# Altium schematic sheet Power.SchDoc
size A4
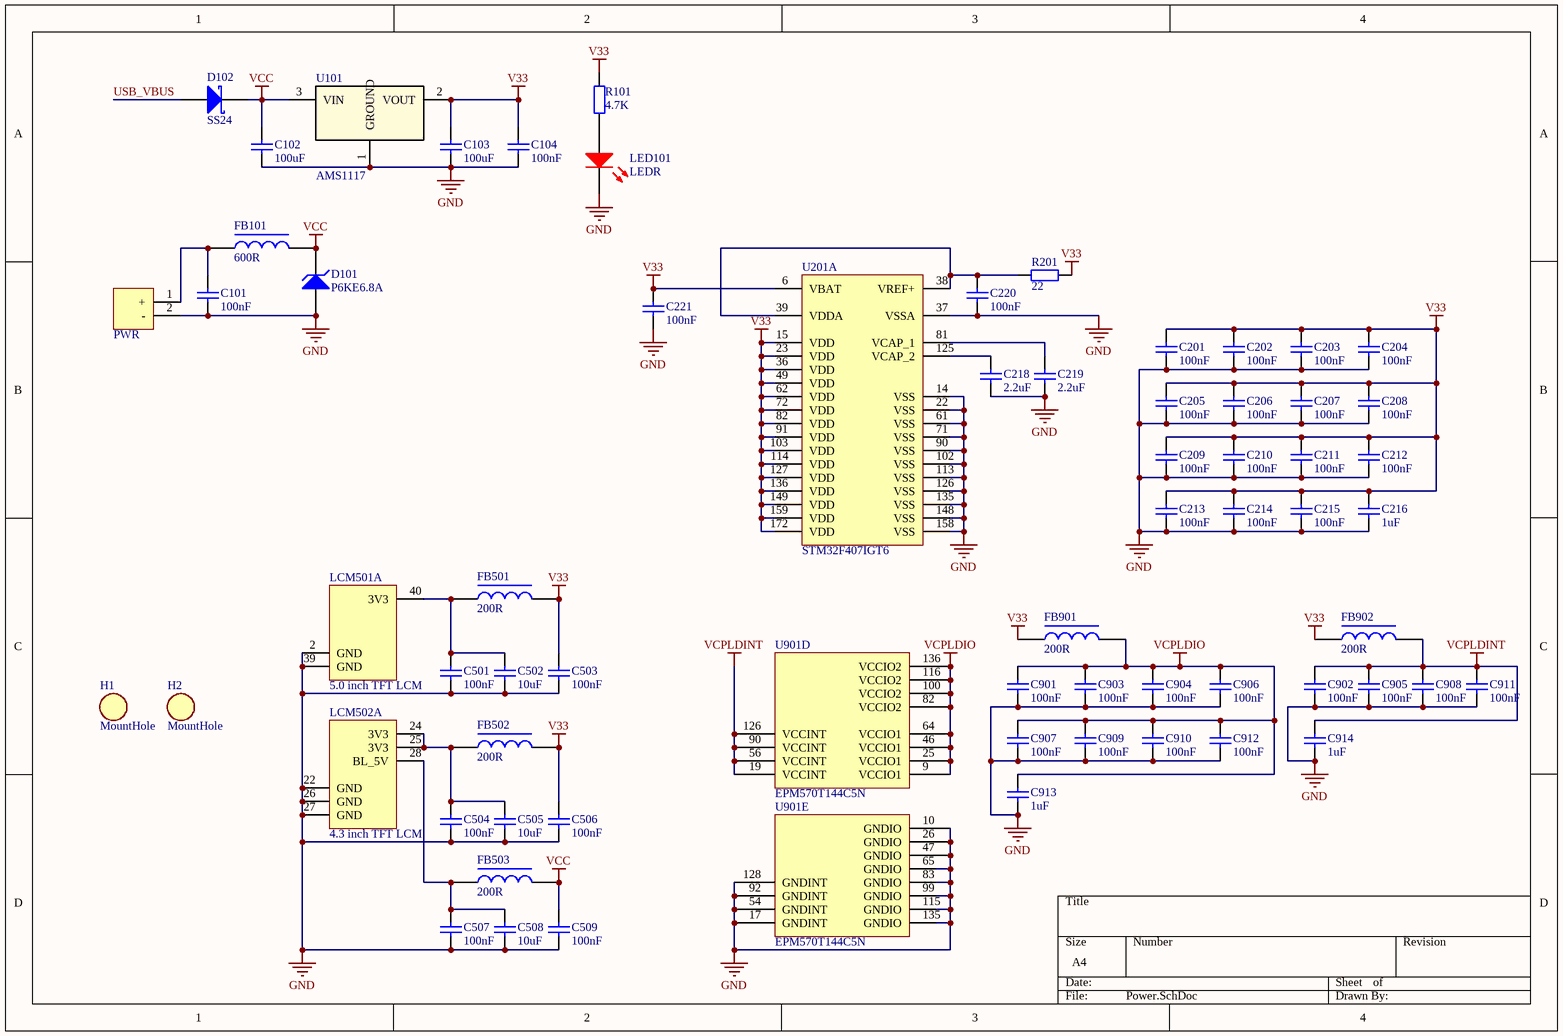
[diagram p0: Power.SchDoc]

## Parts
C101  value 100nF  [0603C]  (hidden comment: MLCC)
C102  value 100uF  [1210C]  (hidden comment: MLCC)
C103  value 100uF  [1210C]  (hidden comment: MLCC)
C104  value 100nF  [0805C]  (hidden comment: MLCC)
C201  value 100nF  [0603C]  (hidden comment: MLCC)
C202  value 100nF  [0603C]  (hidden comment: MLCC)
C203  value 100nF  [0603C]  (hidden comment: MLCC)
C204  value 100nF  [0603C]  (hidden comment: MLCC)
C205  value 100nF  [0603C]  (hidden comment: MLCC)
C206  value 100nF  [0603C]  (hidden comment: MLCC)
C207  value 100nF  [0603C]  (hidden comment: MLCC)
C208  value 100nF  [0603C]  (hidden comment: MLCC)
C209  value 100nF  [0603C]  (hidden comment: MLCC)
C210  value 100nF  [0603C]  (hidden comment: MLCC)
C211  value 100nF  [0603C]  (hidden comment: MLCC)
C212  value 100nF  [0603C]  (hidden comment: MLCC)
C213  value 100nF  [0603C]  (hidden comment: MLCC)
C214  value 100nF  [0603C]  (hidden comment: MLCC)
C215  value 100nF  [0603C]  (hidden comment: MLCC)
C216  value 1uF  [0805C]  (hidden comment: MLCC)
C218  value 2.2uF  [0805C]  (hidden comment: MLCC)
C219  value 2.2uF  [0805C]  (hidden comment: MLCC)
C220  value 100nF  [0603C]  (hidden comment: MLCC)
C221  value 100nF  [0603C]  (hidden comment: MLCC)
C501  value 100nF  [0805C]  (hidden comment: MLCC)
C502  value 10uF  [0805C]  (hidden comment: MLCC)
C503  value 100nF  [0805C]  (hidden comment: MLCC)
C504  value 100nF  [0805C]  (hidden comment: MLCC)
C505  value 10uF  [0805C]  (hidden comment: MLCC)
C506  value 100nF  [0805C]  (hidden comment: MLCC)
C507  value 100nF  [0805C]  (hidden comment: MLCC)
C508  value 10uF  [0805C]  (hidden comment: MLCC)
C509  value 100nF  [0805C]  (hidden comment: MLCC)
C901  value 100nF  [0603C]  (hidden comment: MLCC)
C902  value 100nF  [0603C]  (hidden comment: MLCC)
C903  value 100nF  [0603C]  (hidden comment: MLCC)
C904  value 100nF  [0603C]  (hidden comment: MLCC)
C905  value 100nF  [0603C]  (hidden comment: MLCC)
C906  value 100nF  [0603C]  (hidden comment: MLCC)
C907  value 100nF  [0603C]  (hidden comment: MLCC)
C908  value 100nF  [0603C]  (hidden comment: MLCC)
C909  value 100nF  [0603C]  (hidden comment: MLCC)
C910  value 100nF  [0603C]  (hidden comment: MLCC)
C911  value 100nF  [0603C]  (hidden comment: MLCC)
C912  value 100nF  [0603C]  (hidden comment: MLCC)
C913  value 1uF  [0805C]  (hidden comment: MLCC)
C914  value 1uF  [0805C]  (hidden comment: MLCC)
D101  P6KE6.8A  [SMB]
D102  SS24  [SMA]
FB101  value 600R  [1206L]  (hidden comment: FerriteBead)
FB501  value 200R  [0805L]  (hidden comment: FerriteBead)
FB502  value 200R  [0805L]  (hidden comment: FerriteBead)
FB503  value 200R  [0805L]  (hidden comment: FerriteBead)
FB901  value 200R  [0805L]  (hidden comment: FerriteBead)
FB902  value 200R  [0805L]  (hidden comment: FerriteBead)
H1  MountHole  [MOUNTHOLE]
H2  MountHole  [MOUNTHOLE]
LCM501  5.0 inch TFT LCM  [LCM5.0]  (part A of 3)
LCM502  4.3 inch TFT LCM  [LCM4.3_ATK]  (part A of 3)
LED101  LEDR  [LED1206R]
PWR  WPORT2_PWR  [VH3.96-POWER-2P]  (value not drawn)
R101  value 4.7K  [0603R]  (hidden comment: Resistor)
R201  value 22  [0603R]  (hidden comment: Resistor)
U101  AMS1117  [DCY4]
U201  STM32F407IGT6  [STM-LQFP176_N]  (part A of 7)
U901  EPM570T144C5N  [TQFP144_N]  (parts D,E of 5)

## Nets
GND: C101.1 C102.1 C103.1 C104.1 C201.1 C202.1 C203.1 C204.1 C205.1 C206.1 C207.1 C208.1 C209.1 C210.1 C211.1 C212.1 C213.1 C214.1 C215.1 C216.1 C218.1 C219.1 C220.1 C221.1 C501.1 C502.1 C503.1 C504.1 C505.1 C506.1 C507.1 C508.1 C509.1 C901.1 C902.1 C903.1 C904.1 C905.1 C906.1 C907.1 C908.1 C909.1 C910.1 C911.1 C912.1 C913.1 C914.1 D101.1(A) LCM501.2(GND) LCM501.39(GND) LCM502.22(GND) LCM502.26(GND) LCM502.27(GND) LED101.2(K) PWR.2(-) U101.1(GROUND) U201.14(VSS) U201.22(VSS) U201.37(VSSA) U201.61(VSS) U201.71(VSS) U201.90(VSS) U201.102(VSS) U201.113(VSS) U201.126(VSS) U201.135(VSS) U201.148(VSS) U201.158(VSS) U901.10(GNDIO) U901.17(GNDINT) U901.26(GNDIO) U901.47(GNDIO) U901.54(GNDINT) U901.65(GNDIO) U901.83(GNDIO) U901.92(GNDINT) U901.99(GNDIO) U901.115(GNDIO) U901.128(GNDINT) U901.135(GNDIO)
V33: C103.2 C104.2 C201.2 C202.2 C203.2 C204.2 C205.2 C206.2 C207.2 C208.2 C209.2 C210.2 C211.2 C212.2 C213.2 C214.2 C215.2 C216.2 C221.2 C503.2 C506.2 FB501.2 FB502.2 FB901.1 FB902.1 R101.2 R201.2 U101.2(VOUT) U201.6(VBAT) U201.15(VDD) U201.23(VDD) U201.36(VDD) U201.49(VDD) U201.62(VDD) U201.72(VDD) U201.82(VDD) U201.91(VDD) U201.103(VDD) U201.114(VDD) U201.127(VDD) U201.136(VDD) U201.149(VDD) U201.159(VDD) U201.172(VDD)
VCC: C102.2 C509.2 D101.2(K) D102.2(K) FB101.2 FB503.2 U101.3(VIN)
VCPLDINT: C902.2 C905.2 C908.2 C911.2 C914.2 FB902.2 U901.19(VCCINT) U901.56(VCCINT) U901.90(VCCINT) U901.126(VCCINT)
VCPLDIO: C901.2 C903.2 C904.2 C906.2 C907.2 C909.2 C910.2 C912.2 C913.2 FB901.2 U901.9(VCCIO1) U901.25(VCCIO1) U901.46(VCCIO1) U901.64(VCCIO1) U901.82(VCCIO2) U901.100(VCCIO2) U901.116(VCCIO2) U901.136(VCCIO2)
USB_VBUS: D102.1(A)
NetC101_2: C101.2 FB101.1 PWR.1(+)
NetC218_2: C218.2 U201.125(VCAP_2)
NetC219_2: C219.2 U201.81(VCAP_1)
NetC220_2: C220.2 R201.1 U201.38(VREF+) U201.39(VDDA)
NetC501_2: C501.2 C502.2 FB501.1 LCM501.40(3V3)
NetC504_2: C504.2 C505.2 FB502.1 LCM502.24(3V3) LCM502.25(3V3)
NetC507_2: C507.2 C508.2 FB503.1 LCM502.28(BL_5V)
NetLED101_1: LED101.1(A) R101.1

## Library data of the parts
D101 = P6KE6.8A: 600 Watt Peak Power Surmetict-40 Zener TransientVoltage Suppressors
D102 = SS24: Schottky Rectifier
H1 H2 = MountHole: 3mm mount hole
LCM501 = LCM5.0
LCM502 = LCM4.3_ATK
LED101 = LEDR: RED LED
PWR = WPORT2_PWR: 2 pin power port
U101 = AMS1117: 800mA LOW DROPOUT VOLTAGE REGULATOR
U201 = STM32F407IGT6: ARM Cortex-M4 32-bit MCU+FPU, 210 DMIPS, 1024 kB Flash, 192 kB Internal RAM, 140 I/Os, 176-pin LQFP, -40 to 85 degC, Tray; Manufacturer: STMicroelectronics; D/A Converter: 2x12-bit; FLASH Size (Prog) (kB): 1024; I/Os (High Current): 140; Internal RAM Size (kB): 192; Operating Frequency(F) (Processor speed) (MHz): 168; Supply Voltage(Vcc) max (V): 3.6; Supply Voltage(Vcc) min (V): 1.8; DatasheetVersion: Rev. 4; PackageVersion: Rev. 4, 06/2013; PackageReference: LQFP176; PackageDescription: 176-Pin Low Profile Quad Flat Package, 24 x 24 mm Body, 0.5 mm Pitch; Supplier 1: Digi-Key; Supplier Part Number 1: 497-11604-ND; Supplier 2: Farnell; Supplier Part Number 2: 2064366; Supplier 3: Newark; Supplier Part Number 3: 73T2331; Supplier 4: Mouser; Supplier Part Number 4: 511-STM32F407IGT6; Core: ARM Cortex-M4; Packing: Tray; Mounting Technology: Surface Mount; PartNumber: STM32F407IGT6; ComponentLink1Description: Manufacturer URL; ComponentLink1URL: http://www.st.com/web/en/home.html; ComponentLink2Description: Datasheet; ComponentLink2URL: http://www.st.com/st-web-ui/static/active/en/resource/technical/document/datasheet/DM00037051.pdf; ComponentLink3Description: Package Specification; ComponentLink3URL: http://www.st.com/st-web-ui/static/active/en/resource/technical/document/datasheet/DM00035129.pdf
U901 = EPM570T144C5N: MAX II 3.3/2.5V CPLD, 116 IOs, 570 Logic Elements, 144-Pin Plastic TQFP, Commercial Temperature, Speed Grade 5, Pb-Free; Note: Each set of VCCIO pins can be connected to 3.3V, 2.5V, 1.8V, or 1.5V.; Note: All VCCINT pins must be connected to either 3.3V or 2.5V (but not a combination of both).; DatasheetVersion: ver1.8, Jul-2006; PackageVersion: ver16.3, Dec-2010; PackageReference: TQFP144; PackageDescription: 144-Pin Plastic Thin Quad Flat Pack (TQFP144) - Wire Bond; Code_JEDEC: MS-026-BFB; ComponentLink1Description: Manufacturer URL; ComponentLink1URL: http://www.altera.com/; ComponentLink2Description: Handbook; ComponentLink2URL: http://www.altera.com/literature/hb/max2/max2_mii5v1.pdf; ComponentLink3Description: Package Specification; ComponentLink3URL: http://www.altera.com/literature/ds/dspkg.pdf